# EAGLE schematic Atmega32_Breakout (EAGLE 6.5.0)
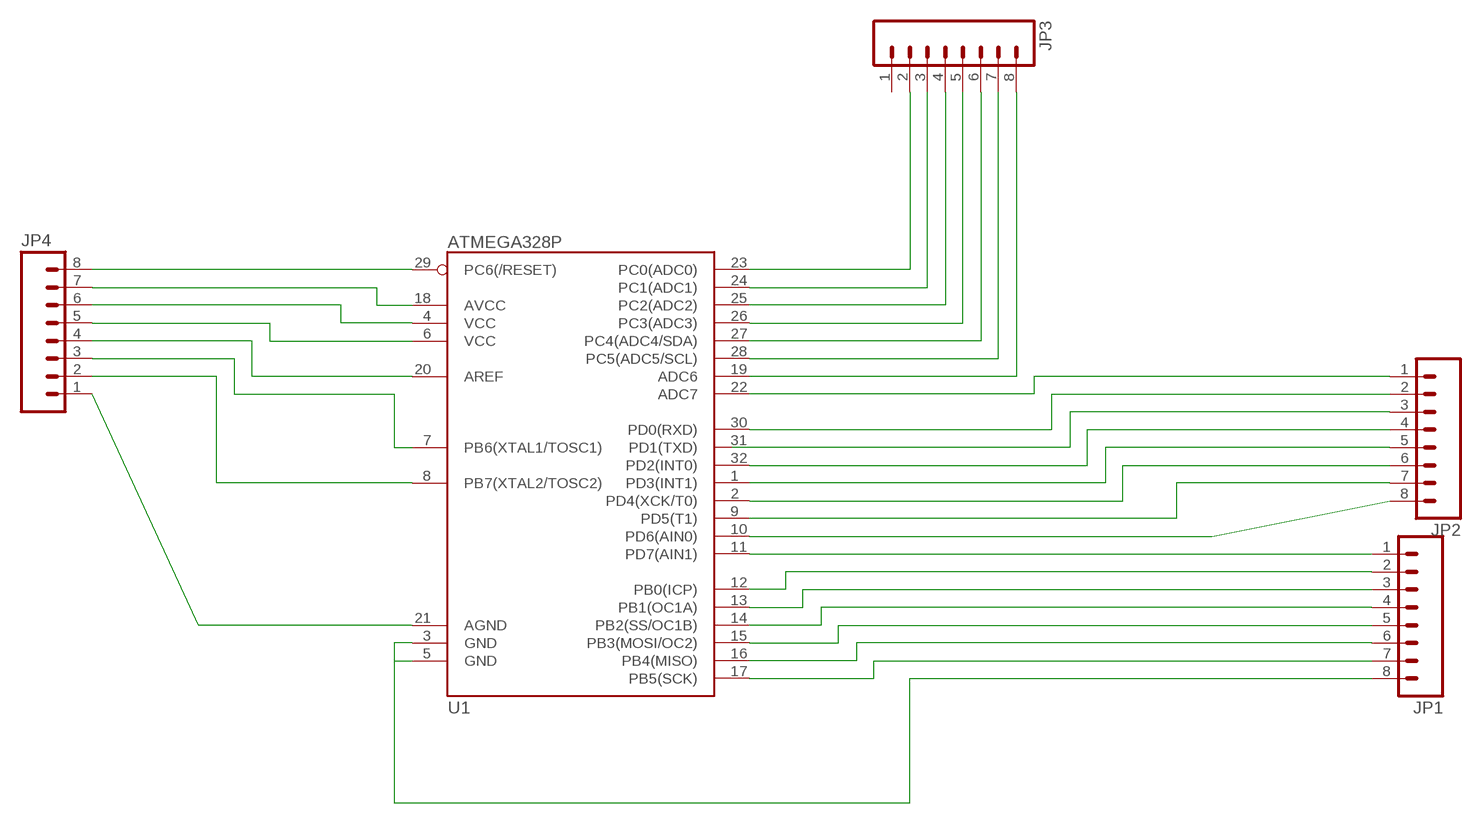
[diagram p0: schematic, sheet 1]

## Parts
JP1  M08  [1X08_PIN1_NO_SILK]
JP2  M08  [1X08_PIN1_NO_SILK]
JP3  M08  [1X08_PIN1_NO_SILK]
JP4  M08  [1X08_PIN1_NO_SILK]
U1  ATMEGA328P  ATMEGA328_SMT  [TQFP32-08]

## Nets
ADC6: JP3.8 U1.19(ADC6)
ADC7: JP2.1 U1.22(ADC7)
AGND: JP4.1 U1.21(AGND)
AREF: JP4.4 U1.20(AREF)
AVCC: JP4.7 U1.18(AVCC)
GND: JP1.8 U1.3(GND) U1.5(GND)
PB0: JP1.2 U1.12(PB0(ICP))
PB1: JP1.3 U1.13(PB1(OC1A))
PB2: JP1.4 U1.14(PB2(SS/OC1B))
PB3: JP1.5 U1.15(PB3(MOSI/OC2))
PB4: JP1.6 U1.16(PB4(MISO))
PB5: JP1.7 U1.17(PB5(SCK))
PB6: JP4.3 U1.7(PB6(XTAL1/TOSC1))
PB7: JP4.2 U1.8(PB7(XTAL2/TOSC2))
PC0: JP3.2 U1.23(PC0(ADC0))
PC1: JP3.3 U1.24(PC1(ADC1))
PC2: JP3.4 U1.25(PC2(ADC2))
PC3: JP3.5 U1.26(PC3(ADC3))
PC4: JP3.6 U1.27(PC4(ADC4/SDA))
PC5: JP3.7 U1.28(PC5(ADC5/SCL))
PD0: JP2.2 U1.30(PD0(RXD))
PD1: JP2.3
PD2: JP2.4 U1.32(PD2(INT0))
PD3: JP2.5 U1.1(PD3(INT1))
PD4: JP2.6 U1.2(PD4(XCK/T0))
PD5: JP2.7 U1.9(PD5(T1))
PD6: JP2.8 U1.10(PD6(AIN0))
PD7: JP1.1 U1.11(PD7(AIN1))
RES: JP4.8 U1.29(PC6(/RESET))
VCC: JP4.5 JP4.6 U1.4(VCC) U1.6(VCC)
Unconnected: JP3.1 U1.31(PD1(TXD))

## Library data of the parts
JP1-JP4 = SparkFun-Connectors:M08: Header 8 Standard 8-pin 0.1" header. Use with straight break away headers (SKU : PRT-00116), right angle break away headers (PRT-00553), swiss pins (PRT-00743), machine pins (PRT-00117), and female headers (PRT-00115).
U1 = SparkFun-DigitalIC:ATMEGA328_SMT: 32-Pin Atmega328 part Commonly used on Arduino compatible boards Available in QFP and QFN packages TQFP is IC-09069 QFN is non-stock; PROD_ID: IC-09069